# Altium schematic sheet BMS Carrier - Battery Relay Controls.SchDoc: BMS Fan and Relay Control
size B; Author: Kevin Chen, Taiping Li; DocumentNumber: 4; SheetNumber: 4; SheetTotal: 4; Website: www.uwmidsun.com
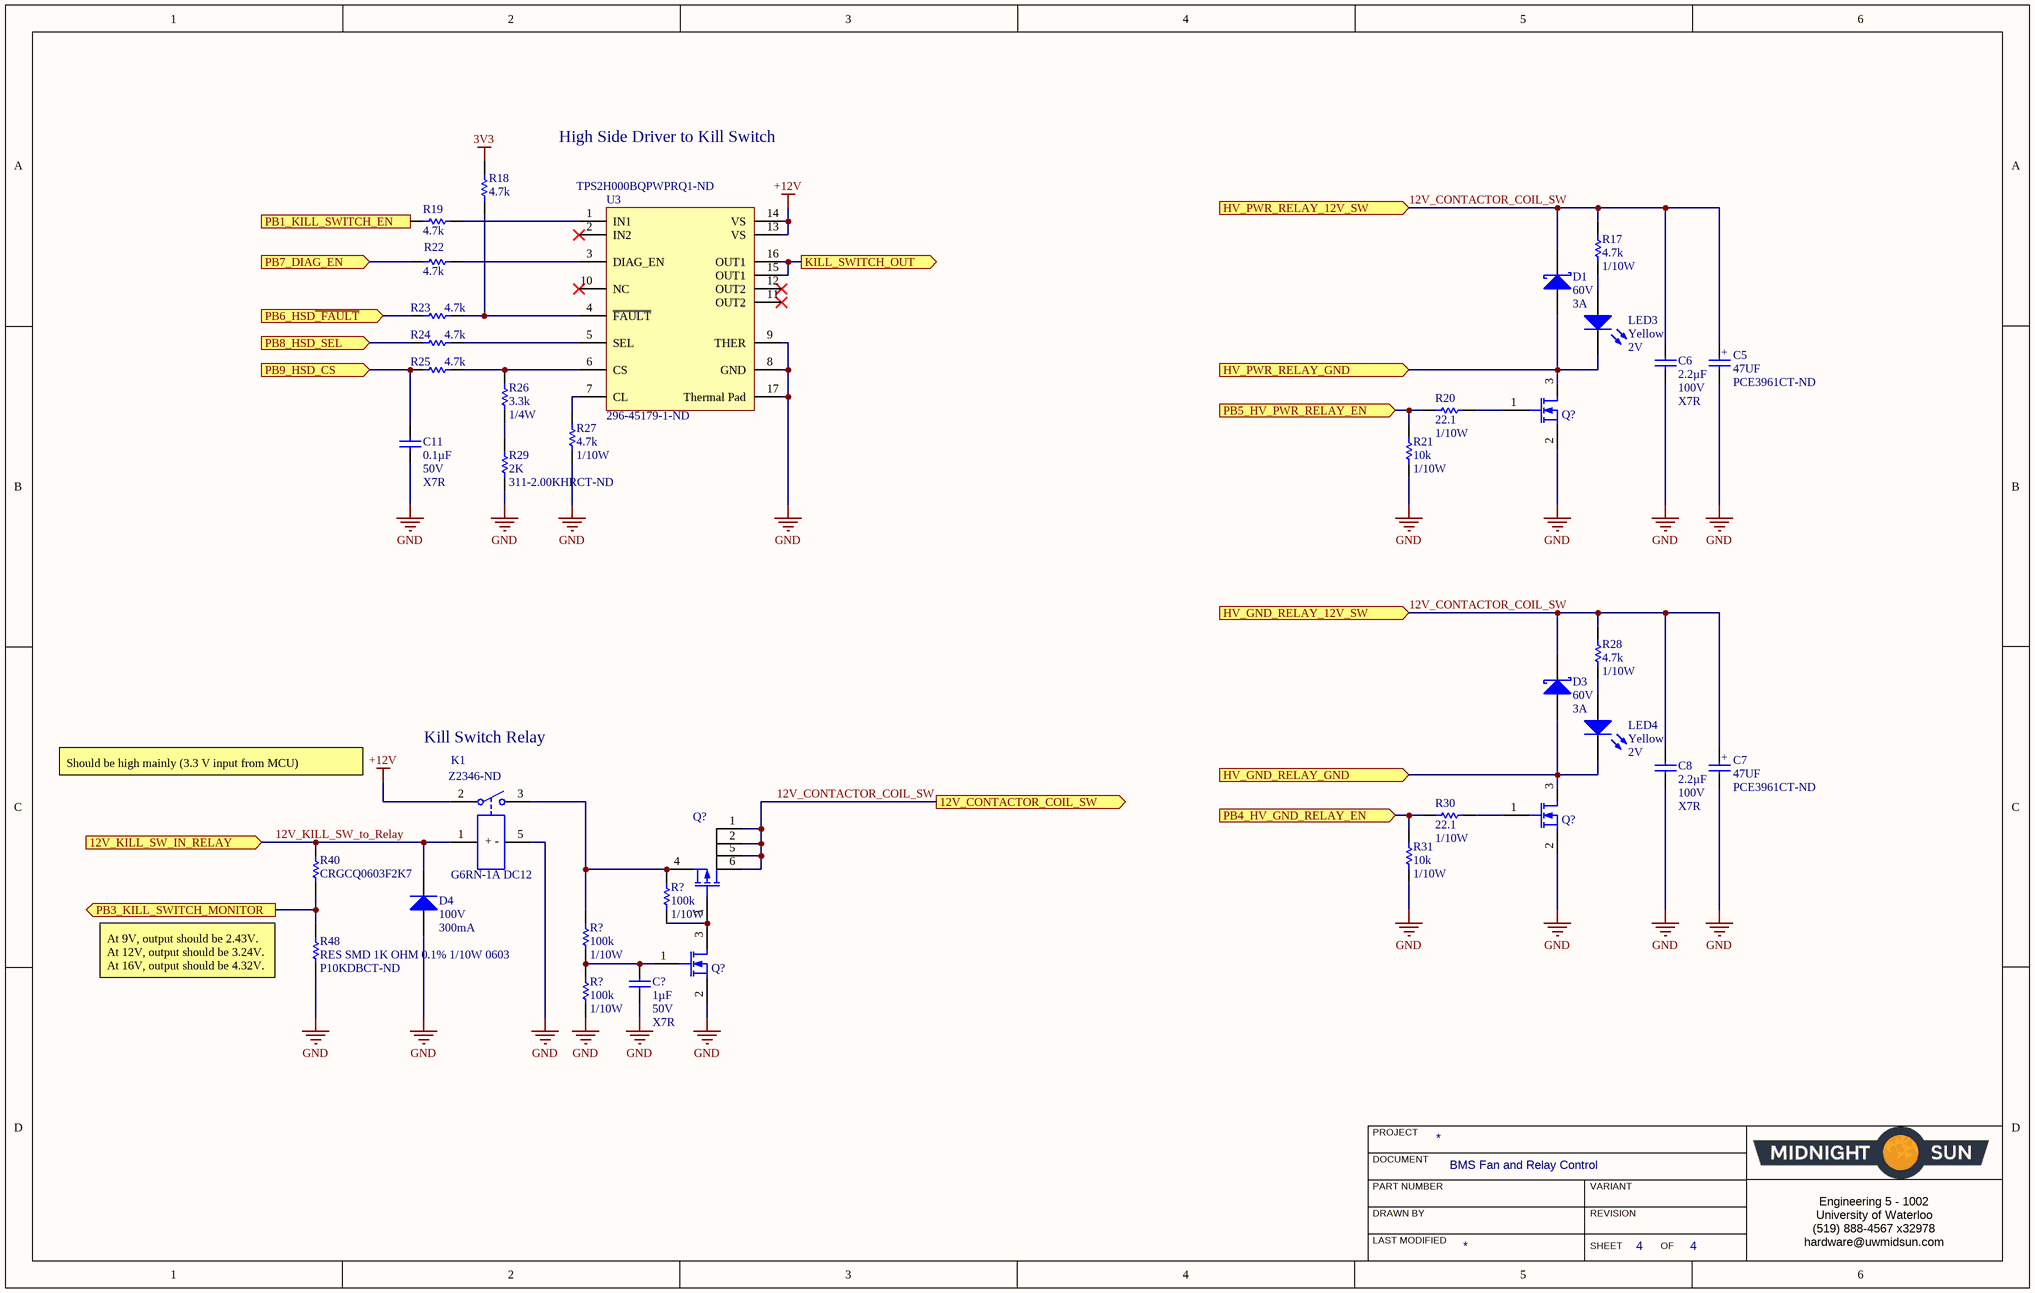
[diagram p0: BMS Carrier - Battery Relay Controls.SchDoc]

## Parts
(Parts that share a designator on the sheet are numbered #1, #2 ... from top to bottom, then left to right.)
C5  47UF  Supplier Part Number 1: PCE3961CT-ND  [CAP ALUM 6.3MM RADIAL SMD]
C6  Capacitance: 2.2µF  Voltage: 100V  Temperature Coefficient: X7R  [CAP, 1206]  (hidden comment: CAP CER 2.2UF 100V ±20% X7R 1206)
C7  47UF  Supplier Part Number 1: PCE3961CT-ND  [CAP ALUM 6.3MM RADIAL SMD]
C8  Capacitance: 2.2µF  Voltage: 100V  Temperature Coefficient: X7R  [CAP, 1206]  (hidden comment: CAP CER 2.2UF 100V ±20% X7R 1206)
C11  Capacitance: 0.1µF  Voltage: 50V  Temperature Coefficient: X7R  [CAP, 0603]  (hidden comment: CAP CER 0.1UF 50V 10% X7R 0603)
C?  Capacitance: 1µF  Voltage: 50V  Temperature Coefficient: X7R  [CAP, 0603]  (hidden comment: CAP CER 1UF 50V 10% X7R 0603)
D1  Voltage - DC Reverse (Vr) (Max): 60V  Current - Average Rectified (Io): 3A  [Diode, SMA]  (hidden comment: DIODE SCHOTTKY 60V 3A SMA)
D3  Voltage - DC Reverse (Vr) (Max): 60V  Current - Average Rectified (Io): 3A  [Diode, SMA]  (hidden comment: DIODE SCHOTTKY 60V 3A SMA)
D4  Max Repetitive Reverse Voltage (Vrrm): 100V  Forward Current: 300mA  [DIODE GEN PURP 100V 300MA SOD123]  (hidden comment: DIODE GEN PURP 100V 300MA SOD123)
K1  G6RN-1A DC12  Supplier Part Number 2: Z2346-ND  [RELAY SPST 8A 12VDC]
LED3  Color: Yellow  Voltage - Forward (Vf) (Typ): 2V  [LED_0603]  (hidden comment: LED YELLOW CLEAR 2.1V 0603)
LED4  Color: Yellow  Voltage - Forward (Vf) (Typ): 2V  [LED_0603]  (hidden comment: LED YELLOW CLEAR 2.1V 0603)
Q?#1  MOSFET N-CH 30V 6.2A 0.9W SOT-23  [MOSFET N-CH 30V 6.2A 0.9W SOT-23]  (value not drawn)
Q?#2  MOSFET N-CH 30V 6.2A 0.9W SOT-23  [MOSFET N-CH 30V 6.2A 0.9W SOT-23]  (value not drawn)
Q?#3  MOSFET P-CH 30V 4A 1.6W SOT-23-6  [P-MOSFET]  (value not drawn)
Q?#4  MOSFET N-CH 30V 6.2A 0.9W SOT-23  [MOSFET N-CH 30V 6.2A 0.9W SOT-23]  (value not drawn)
R17  Resistance (Ohms): 4.7k  Power (Watts): 1/10W  [RES, 0603]  (hidden comment: RES 4.7K OHM 1% 1/10W 0603)
R18  Resistance (Ohms): 4.7k  [RES, 0603]  (hidden comment: RES 10K OHM 1% 1/10W 0603)
R19  Resistance (Ohms): 4.7k  [RES, 0603]  (hidden comment: RES 4.7K OHM 1% 1/10W 0603)
R20  Resistance: 22.1  Power: 1/10W  [RES, 0603]  (hidden comment: RES 22.1 OHM 1% 1/10W 0603)
R21  Resistance: 10k  Power: 1/10W  [RES, 0603]  (hidden comment: RES 10K OHM 1% 1/10W 0603)
R22  Resistance (Ohms): 4.7k  [RES, 0603]  (hidden comment: RES 4.7K OHM 1% 1/10W 0603)
R23  Resistance (Ohms): 4.7k  [RES, 0603]  (hidden comment: RES 4.7K OHM 1% 1/10W 0603)
R24  Resistance (Ohms): 4.7k  [RES, 0603]  (hidden comment: RES 4.7K OHM 1% 1/10W 0603)
R25  Resistance (Ohms): 4.7k  [RES, 0603]  (hidden comment: RES 4.7K OHM 1% 1/10W 0603)
R26  Resistance: 3.3k  Power: 1/4W  [RES, 0603]  (hidden comment: RES 3.3K OHM 1% 1/4W 0603)
R27  Resistance (Ohms): 4.7k  Power (Watts): 1/10W  [RES, 0603]  (hidden comment: RES 4.7K OHM 1% 1/10W 0603)
R28  Resistance (Ohms): 4.7k  Power (Watts): 1/10W  [RES, 0603]  (hidden comment: RES 4.7K OHM 1% 1/10W 0603)
R29  2K  Supplier Part Number 1: 311-2.00KHRCT-ND  [RES, 0603]
R30  Resistance: 22.1  Power: 1/10W  [RES, 0603]  (hidden comment: RES 22.1 OHM 1% 1/10W 0603)
R31  Resistance: 10k  Power: 1/10W  [RES, 0603]  (hidden comment: RES 10K OHM 1% 1/10W 0603)
R40  Manufacturer Part Number: CRGCQ0603F2K7  [RES, 0603]  (hidden comment: RES 2.7K OHM 1% 1/10W 0603)
R48  RES SMD 1K OHM 0.1% 1/10W 0603  Supplier Part Number 1: P10KDBCT-ND  [RES, 0603]
R?#1  Resistance: 100k  Power: 1/10W  [RES, 0603]  (hidden comment: RES 100K OHM 5% 1/8W 0603)
R?#2  Resistance: 100k  Power: 1/10W  [RES, 0603]  (hidden comment: RES 100K OHM 5% 1/8W 0603)
R?#3  Resistance: 100k  Power: 1/10W  [RES, 0603]  (hidden comment: RES 100K OHM 5% 1/8W 0603)
U3  296-45179-1-ND  Supplier Part Number 1: TPS2H000BQPWPRQ1-ND  [IC HSD Dual-Channel TSOP65P640X120_HS-17N]

## Ports
12V_CONTACTOR_COIL_SW (out), 12V_KILL_SW_IN_RELAY (in), HV_GND_RELAY_12V_SW (in), HV_GND_RELAY_GND (in), HV_PWR_RELAY_12V_SW (in), HV_PWR_RELAY_GND (in), KILL_SWITCH_OUT (out), PB1_KILL_SWITCH_EN (in), PB3_KILL_SWITCH_MONITOR (out), PB4_HV_GND_RELAY_EN (in), PB5_HV_PWR_RELAY_EN (in), PB6_HSD~{_FAULT} (in), PB7_DIAG_EN (in), PB8_HSD_SEL (in), PB9_HSD_CS (in)

## Nets
3V3: R18.2
+12V: K1.2 U3.13(VS) U3.14(VS)
GND: C5.2 C6.2 C7.2 C8.2 C11.2 C?.2 D4.1(A) K1.5(-) Q?#1.2(S) Q?#2.2(S) Q?#4.2(S) R21.2 R27.2 R29.2 R31.2 R48.1 R?#3.2 U3.8(GND) U3.9(THER) U3.17(Thermal_Pad)
12V_CONTACTOR_COIL_SW: C5.1 C6.1 C7.1 C8.1 D1.2 D3.2 Q?#3.1(D) Q?#3.2(D) Q?#3.5(D) Q?#3.6(D) R17.1 R28.1 ; port HV_PWR_RELAY_12V_SW, port HV_GND_RELAY_12V_SW, port 12V_CONTACTOR_COIL_SW
12V_KILL_SW_to_Relay: D4.2(K) K1.1(+) R40.1 ; port 12V_KILL_SW_IN_RELAY
HV_GND_RELAY_GND: D3.1 LED4.2(K) Q?#2.3(D) ; port HV_GND_RELAY_GND
HV_PWR_RELAY_GND: D1.1 LED3.2(K) Q?#1.3(D) ; port HV_PWR_RELAY_GND
KILL_SWITCH_OUT: U3.15(OUT1) U3.16(OUT1) ; port KILL_SWITCH_OUT
PB1_KILL_SWITCH_EN: R19.1 ; port PB1_KILL_SWITCH_EN
PB3_KILL_SWITCH_MONITOR: R40.2 R48.2 ; port PB3_KILL_SWITCH_MONITOR
PB4_HV_GND_RELAY_EN: R30.1 R31.1 ; port PB4_HV_GND_RELAY_EN
PB5_HV_PWR_RELAY_EN: R20.1 R21.1 ; port PB5_HV_PWR_RELAY_EN
PB6_HSD~{_FAULT}: R23.1 ; port PB6_HSD~{_FAULT}
PB7_DIAG_EN: R22.1 ; port PB7_DIAG_EN
PB8_HSD_SEL: R24.1 ; port PB8_HSD_SEL
PB9_HSD_CS: C11.1 R25.1 ; port PB9_HSD_CS
NetC?_1: C?.1 Q?#4.1(G) R?#1.2 R?#3.1
NetK1_3: K1.3 Q?#3.4(S) R?#1.1 R?#2.2
NetLED3_1: LED3.1(A) R17.2
NetLED4_1: LED4.1(A) R28.2
NetQ?#1_1: Q?#1.1(G) R20.2
NetQ?#2_1: Q?#2.1(G) R30.2
NetQ?#3_3: Q?#3.3(G) Q?#4.3(D) R?#2.1
NetR18_1: R18.1 R23.2 U3.4(~{FAULT})
NetR19_2: R19.2 U3.1(IN1)
NetR22_2: R22.2 U3.3(DIAG_EN)
NetR24_2: R24.2 U3.5(SEL)
NetR25_2: R25.2 R26.1 U3.6(CS)
NetR26_2: R26.2 R29.1
NetR27_1: R27.1 U3.7(CL)

Not connected (* = marked no-connect by the designer): U3 2(IN2)* 10(NC)* 11(OUT2)* 12(OUT2)*

## Notes on the sheet
- High Side Driver to Kill Switch
- Should be high mainly (3.3 V input from MCU)
- Kill Switch Relay
- At 9V, output should be 2.43V. At 12V, output should be 3.24V. At 16V, output should be 4.32V.
- PROJECT
- DOCUMENT
- DRAWN BY
- LAST MODIFIED
- PART NUMBER
- REVISION
- SHEET
- VARIANT
- OF
- Engineering 5 - 1002
  University of Waterloo
  (519) 888-4567 x32978
  hardware@uwmidsun.com
- (in symbol CAP ALUM 47UF 20% 35V SMD) +
- (in symbol RELAY SPST 12V 8A OMRON) + -

## Library data of the parts
C5 C7 = CAP ALUM 47UF 20% 35V SMD: 47µF 35V Aluminum Electrolytic Capacitors Radial, Can - SMD 1000 Hrs @ 85°C; Manufacturer: Panasonic; Manufacturer Part Number: EEE-1VA470WP; Ripple Current: 70mA; Tolerance: 20%; Life (Hours): 1000Hour; Supplier 1: Digi-Key; Stock 1: 2820; Pricing 1: 1=0.38, 10=0.263, 100=0.1579, 500=0.11846 (USD); Mount: Surface Mount,PCB; Case/Package: Radial; Min Operating Temperature: -40°C; Max Operating Temperature: 85°C; Voltage Rating: 35V; Ripple Current (AC): 70mA; Packaging: Tape and Reel; Package Quantity: 1; Termination: SMD/SMT; Diameter: 6.3mm; Length: 5.5mm; Height: 5.4mm; Height - Seated (Max): 0.213inch; Radiation Hardening: No; REACH SVHC: Unknown; Lead Free: Lead Free; ComponentLink1URL: https://datasheet.ciiva.com/2983/aba0000ce2-2983926.pdf; ComponentLink1Description: https://datasheet.ciiva.com/2983/aba0000ce2-2983926.pdf; ComponentLink2URL: https://datasheet.ciiva.com/2983/aba0000ce2-2983927.pdf; ComponentLink2Description: https://datasheet.ciiva.com/2983/aba0000ce2-2983927.pdf; ComponentLink3URL: https://datasheet.ciiva.com/14598/70255710-14598937.pdf; ComponentLink3Description: https://datasheet.ciiva.com/14598/70255710-14598937.pdf; ComponentLink4URL: https://datasheet.ciiva.com/15165/getdatasheetpartid-86239-15165868.pdf; ComponentLink4Description: https://datasheet.ciiva.com/15165/getdatasheetpartid-86239-15165868.pdf; ComponentLink5URL: https://datasheet.ciiva.com/16507/aba0000ce2-16507965.pdf; ComponentLink5Description: https://datasheet.ciiva.com/16507/aba0000ce2-16507965.pdf; ComponentLink6URL: https://datasheet.ciiva.com/30206/11aba0000ce2-30206253.pdf; ComponentLink6Description: https://datasheet.ciiva.com/30206/11aba0000ce2-30206253.pdf; Capacitance: 47uF; Voltage Rating (DC): 35V; Contact Plating: Tin
C6 C8 = CAP CER 2.2UF 100V ±20% X7R 1206: 2.2µF ±20% 100V Ceramic Capacitor X7R 1206 (3216 Metric); Manufacturer 1: Murata Electronics North America; Manufacturer Part Number 1: GRM31CR72A225MA73L; Supplier 1: Digi-Key; Supplier Part Number 1: 490-12773-1-ND; Packaging: Cut Tape (CT); Part Status: Active; Operating Temperature: -55°C ~ 125°C; Ratings: -; Mounting Type: Surface Mount, MLCC; Package / Case: 1206 (3216 Metric); Size / Dimension: 0.126" L x 0.063" W (3.20mm x 1.60mm); Height - Seated (Max): -; Thickness (Max): 0.071" (1.80mm); Lead Spacing: -; Lead Style: -; ComponentLink1URL: http://www.murata.com/~/media/webrenewal/support/library/catalog/products/capacitor/mlcc/c02e.ashx; ComponentLink1Description: http://www.murata.com/~/media/webrenewal/support/library/catalog/products/capacitor/mlcc/c02e.ashx; Tolerance: ±20%
C11 = CAP CER 0.1UF 50V 10% X7R 0603: 0.10µF ±10% 50V Ceramic Capacitor X7R 0603 (1608 Metric); Manufacturer 1: AVX Corporation; Manufacturer Part Number 1: 06035C104KAT2A; Supplier 1: Digi-Key; Supplier Part Number 1: 478-5052-1-ND; Packaging: Cut Tape (CT); Part Status: Active; Operating Temperature: -55°C ~ 125°C; Ratings: -; Mounting Type: Surface Mount, MLCC; Package / Case: 0603 (1608 Metric); Size / Dimension: 0.063" L x 0.032" W (1.60mm x 0.81mm); Height - Seated (Max): -; Thickness (Max): 0.035" (0.90mm); Lead Spacing: -; Lead Style: -; ComponentLink1URL: http://datasheets.avx.com/X7RDielectric.pdf; ComponentLink1Description: http://datasheets.avx.com/X7RDielectric.pdf; Tolerance: ±10%
C? = CAP CER 1UF 50V 10% X7R 0603: 1µF ±10% 50V Ceramic Capacitor X7R 0603 (1608 Metric); Manufacturer 1: Taiyo Yuden; Manufacturer Part Number 1: UMK107AB7105KA-T; Supplier 1: Digi-Key; Supplier Part Number 1: 587-3247-1-ND; Packaging: Cut Tape (CT); Part Status: Active; Operating Temperature: -55°C ~ 125°C; Ratings: -; Mounting Type: Surface Mount, MLCC; Package / Case: 0603 (1608 Metric); Size / Dimension: 0.063" L x 0.031" W (1.60mm x 0.80mm); Height - Seated (Max): -; Thickness (Max): 0.037" (0.95mm); Lead Spacing: -; Lead Style: -; ComponentLink1URL: http://www.yuden.co.jp/productdata/catalog/en/mlcc_all_e.pdf; ComponentLink1Description: http://www.yuden.co.jp/productdata/catalog/en/mlcc_all_e.pdf; Tolerance: ±10%
D1 D3 = DIODE SCHOTTKY 60V 3A SMA: Diode Schottky 60V 3A Surface Mount SMA; Manufacturer 1: Diodes Incorporated; Manufacturer Part Number 1: B360A-13-F; Voltage - Forward (Vf) (Max) @ If: 700mV @ 3A; Speed: Fast Recovery =< 500ns, > 200mA (Io); Current - Reverse Leakage @ Vr: 500µA @ 60V; Capacitance @ Vr, F: 200pF @ 4V, 1MHz; Supplier 1: Digi-Key; Supplier Part Number 1: B360A-FDICT-ND; Packaging: Cut Tape (CT); Part Status: Active; Diode Type: Schottky; Mounting Type: Surface Mount; Package / Case: DO-214AC, SMA; Supplier Device Package: SMA; Operating Temperature - Junction: -55°C ~ 150°C; ComponentLink1URL: https://www.diodes.com/assets/Datasheets/ds30891.pdf; ComponentLink1Description: https://www.diodes.com/assets/Datasheets/ds30891.pdf
D4 = DIODE GEN PURP 100V 300MA SOD123: Diode Standard 100V 300mA (DC) Surface Mount SOD-123; Manufacturer: Diodes Zetex; Manufacturer Part Number: 1N4148WQ-7-F; Max Surge Current: 2A; Forward Voltage: 1.25V; Element Configuration: Single; Recovery Time: 4ns; Peak Reverse Current: 50uA; Max Power Dissipation: 400mW; Supplier 1: Digi-Key; Stock 1: 229; Pricing 1: 1=0.22, 10=0.196, 100=0.107, 500=0.0658, 1000=0.0449 (USD); Mount: Surface Mount; Case/Package: SOD-123-2; Number of Pins: 2; Weight: 0.000353oz; Contact Plating: Tin,Matte; Min Operating Temperature: -65°C; Max Operating Temperature: 150°C; Packaging: Tape and Reel; Peak Non-Repetitive Surge Current: 2A; Package Quantity: 3000; Reverse Recovery Time: 4ns; Lead Free: Lead Free; ComponentLink1URL: http://components.arrow.com/part/dataview/0323_07206809; ComponentLink1Description: http://components.arrow.com/part/dataview/0323_07206809; ComponentLink2URL: http://www.diodes.com/datasheets/ds30086.pdf; ComponentLink2Description: http://www.diodes.com/datasheets/ds30086.pdf; ComponentLink3URL: http://www.mouser.com/ds/2/115/ds30086-318161.pdf; ComponentLink3Description: http://www.mouser.com/ds/2/115/ds30086-318161.pdf; Supplier Part Number 1: 1N4148WQ-7-FDICT-ND
K1 = RELAY SPST 12V 8A OMRON: Omron Relay SPST (1 Form A) Through Hole; Coil Type: Non Latching; Coil Voltage: 12V; Switching Voltage: 250VAC, 30VDC - Max; Operate Time: 15ms; Coil Power: 220 mW; Contact Form: SPST; Manufacturer Part Number: G6RN-1A DC12; Supplier 1: Digi-Key; Supplier 2: Digi-Key; ComponentLink1Description: Datasheet; ComponentLink1URL: https://omronfs.omron.com/en_US/ecb/products/pdf/en-g6rn.pdf
LED3 LED4 = LED YELLOW CLEAR 2.1V 0603: Yellow 590nm LED Indication - Discrete 2V 0603 (1608 Metric); Manufacturer: Wurth Electronics Inc.; Manufacturer Part Number: 150060YS75000; Lens Color: Colorless; Millicandela Rating: 120mcd; Lens Style/Size: Rectangle with Flat Top, 1.10mm x 0.70mm; Current - Test: 20mA; Viewing Angle: 140°; Wavelength - Peak: 595nm; Supplier 1: Digi-Key; RoHS: RoHS Compliant; Category: Optoelectronics; Stock 1: 10523; Pricing 1: 1=0.21, 100=0.1617, 500=0.13964 (CAD); Packaging: Cut Tape (CT); Part Status: Active; Lens Transparency: Clear; Mounting Type: Surface Mount; Wavelength - Dominant: 590nm; Features: -; Package / Case: 0603 (1608 Metric); Supplier Device Package: 0603; Size / Dimension: 1.60mm L x 0.80mm W; Height (Max): 0.80mm; ComponentLink1URL: http://katalog.we-online.de/led/datasheet/150060YS75000.pdf; ComponentLink1Description: http://katalog.we-online.de/led/datasheet/150060YS75000.pdf; Supplier Part Number 1: 732-4981-1-ND
Q?#1 Q?#2 Q?#4 = MOSFET N-CH 30V 6.2A 0.9W SOT-23: N-Channel 30V 6.2A (Ta) 900mW (Ta) Surface Mount SOT-23; Manufacturer: Diodes; Manufacturer Part Number: DMN3023L-7; Rds On Max: 25mR; Input Capacitance: 873pF; Supplier 1: Digi-Key; Stock 1: 38246; Pricing 1: 1=0.47, 10=0.368, 100=0.2529, 500=0.1734, 1000=0.1301 (USD); Mount: Surface Mount; Case/Package: TO-236-3; Min Operating Temperature: -55°C; Max Operating Temperature: 150°C; Packaging: Tape and Reel; Drain to Source Voltage (Vdss): 30V; Continuous Drain Current (ID): 6.2A; Max Power Dissipation: 900mW; ComponentLink1URL: https://www.diodes.com/assets/Datasheets/DMN3023L.pdf; ComponentLink1Description: https://www.diodes.com/assets/Datasheets/DMN3023L.pdf; ComponentLink2URL: http://www.mouser.com/ds/2/115/DMN3023L-959533.pdf; ComponentLink2Description: http://www.mouser.com/ds/2/115/DMN3023L-959533.pdf; Supplier Part Number 1: DMN3023L-7DICT-ND
Q?#3 = MOSFET P-CH 30V 4A 1.6W SOT-23-6: P-Channel 30V 4A (Ta) 1.6W (Ta) Surface Mount SOT-23-6; Manufacturer 1: STMicroelectronics; Manufacturer Part Number 1: STT4P3LLH6; Current - Continuous Drain (Id) @ 25°C: 4A (Ta); Drive Voltage (Max Rds On,  Min Rds On): 4.5V, 10V; Vgs(th) (Max) @ Id: 2.5V @ 250µA; Gate Charge (Qg) (Max) @ Vgs: 6nC @ 4.5V; Input Capacitance (Ciss) (Max) @ Vds: 639pF @ 25V; Vgs (Max): ±20V; Rds On (Max) @ Id, Vgs: 56 mOhm @ 2A, 10V; Supplier 1: Digi-Key; Supplier Part Number 1: 497-15521-1-ND; Packaging: Cut Tape (CT); Part Status: Active; FET Type: P-Channel; Technology: MOSFET (Metal Oxide); Drain to Source Voltage (Vdss): 30V; FET Feature: -; Power Dissipation (Max): 1.6W (Ta); Operating Temperature: 150°C (TJ); Mounting Type: Surface Mount; Supplier Device Package: SOT-23-6; Package / Case: SOT-23-6; ComponentLink1URL: http://www.st.com/content/ccc/resource/technical/document/datasheet/13/e4/a1/65/8b/79/44/73/DM00084060.pdf/files/DM00084060.pdf/jcr:content/translations/en.DM00084060.pdf; ComponentLink1Description: http://www.st.com/content/ccc/resource/technical/document/datasheet/13/e4/a1/65/8b/79/44/73/DM00084060.pdf/files/DM00084060.pdf/jcr:content/translations/en.DM00084060.pdf
R17-R19 R22-R25 R27 R28 = RES 4.7K OHM 1% 1/10W 0603: 4.7k Ohm ±1% 0.1W, 1/10W Chip Resistor 0603 (1608 Metric) Moisture Resistant Thick Film; Manufacturer 1: Yageo; Manufacturer Part Number 1: RC0603FR-074K7L; Description 1: RES SMD 4.7K OHM 1% 1/10W 0603; Temperature Coefficient: ±100ppm/°C; Supplier 1: Digi-Key; Supplier Part Number 1: 311-4.70KHRCT-ND; RoHS: RoHS Compliant; Category: Resistors; Stock 1: 3487566; Pricing 1: 1=0.16, 10=0.022, 100=0.0089, 1000=0.00402, 2500=0.00349 (CAD); Packaging: Cut Tape (CT); Part Status: Active; Composition: Thick Film; Features: Moisture Resistant; Operating Temperature: -55°C ~ 155°C; Package / Case: 0603 (1608 Metric); Supplier Device Package: 0603; Size / Dimension: 0.063" L x 0.031" W (1.60mm x 0.80mm); Height - Seated (Max): 0.022" (0.55mm); Failure Rate: -; ComponentLink1URL: http://www.yageo.com/documents/recent/PYu-RC_Group_51_RoHS_L_7.pdf; ComponentLink1Description: http://www.yageo.com/documents/recent/PYu-RC_Group_51_RoHS_L_7.pdf; Tolerance: ±1%
  R18 R19 R22-R25: Power (Watts): 1/10W
R20 R30 = RES 22.1 OHM 1% 1/10W 0603: 22.1 Ohm ±1% 0.1W, 1/10W Chip Resistor 0603 (1608 Metric) Moisture Resistant Thick Film; Manufacturer 1: Yageo; Manufacturer Part Number 1: RC0603FR-0722R1L; Temperature Coefficient: ±100ppm/°C; Supplier 1: Digi-Key; Supplier Part Number 1: 311-22.1HRCT-ND; Packaging: Cut Tape (CT); Part Status: Active; Composition: Thick Film; Operating Temperature: -55°C ~ 155°C; Package / Case: 0603 (1608 Metric); Supplier Device Package: 0603; Size / Dimension: 0.063" L x 0.031" W (1.60mm x 0.80mm); Height - Seated (Max): 0.022" (0.55mm); Failure Rate: -; ComponentLink1URL: http://www.yageo.com/documents/recent/PYu-RC_Group_51_RoHS_L_7.pdf; ComponentLink1Description: http://www.yageo.com/documents/recent/PYu-RC_Group_51_RoHS_L_7.pdf; Tolerance: ±1%
R21 R31 = RES 10K OHM 1% 1/10W 0603: RES SMD 10K OHM 1% 1/10W 0603; Manufacturer 1: Yageo; Manufacturer Part Number 1: RC0603FR-0710KL; Temperature Coefficient: ±100ppm/°C; Supplier 1: Digi-Key; Supplier Part Number 1: 311-10.0KHRCT-ND; Packaging: Cut Tape (CT); Part Status: Active; Composition: Thick Film; Operating Temperature: -55°C ~ 155°C; Package / Case: 0603 (1608 Metric); Supplier Device Package: 0603; Size / Dimension: 0.063" L x 0.031" W (1.60mm x 0.80mm); Height - Seated (Max): 0.022" (0.55mm); Failure Rate: -; ComponentLink1URL: http://www.yageo.com/documents/recent/PYu-RC_Group_51_RoHS_L_7.pdf; ComponentLink1Description: http://www.yageo.com/documents/recent/PYu-RC_Group_51_RoHS_L_7.pdf; Tolerance: ±1%
R26 = RES 3.3K OHM 1% 1/4W 0603: 3.3k Ohm ±1% 0.25W, 1/4W Chip Resistor 0603 (1608 Metric) Automotive AEC-Q200, Pulse Withstanding Thick Film; Manufacturer 1: Panasonic Electronic Components; Manufacturer Part Number 1: ERJ-PA3F3301V; Temperature Coefficient: ±100ppm/°C; Supplier 1: Digi-Key; Supplier Part Number 1: P3.3KBYCT-ND; Packaging: Cut Tape (CT); Part Status: Active; Composition: Thick Film; Operating Temperature: -55°C ~ 155°C; Package / Case: 0603 (1608 Metric); Supplier Device Package: 0603; Size / Dimension: 0.063" L x 0.031" W (1.60mm x 0.80mm); Height - Seated (Max): 0.022" (0.55mm); Failure Rate: -; ComponentLink1URL: https://industrial.panasonic.com/cdbs/www-data/pdf/RDO0000/AOA0000C291.pdf; ComponentLink1Description: https://industrial.panasonic.com/cdbs/www-data/pdf/RDO0000/AOA0000C291.pdf; Tolerance: ±1%
R29 = RES 2K OHM 1% 1/10W 0603: 2k Ohm ±1% 0.1W, 1/10W Chip Resistor 0603 (1608 Metric) Moisture Resistant Thick Film; Manufacturer: Yageo; Manufacturer Part Number: RC0603FR-072KL; Temperature Coefficient: ±100ppm/°C; Supplier 1: Digi-Key; RoHS: RoHS Compliant; Category: Resistors; Stock 1: 1750701; Pricing 1: 1=0.15, 10=0.023, 100=0.0093, 1000=0.00415, 2500=0.0036 (CAD); Packaging: Cut Tape (CT); Part Status: Active; Resistance (Ohms): 2k; Tolerance: ±1%; Power (Watts): 0.1W, 1/10W; Composition: Thick Film; Features: Moisture Resistant; Operating Temperature: -55°C ~ 155°C; Package / Case: 0603 (1608 Metric); Supplier Device Package: 0603; Size / Dimension: 0.063" L x 0.031" W (1.60mm x 0.80mm); Height - Seated (Max): 0.022" (0.55mm); Failure Rate: -; ComponentLink1URL: http://www.yageo.com/documents/recent/PYu-RC_Group_51_RoHS_L_7.pdf; ComponentLink1Description: http://www.yageo.com/documents/recent/PYu-RC_Group_51_RoHS_L_7.pdf
R40 = RES 2.7K OHM 1% 1/10W 0603: 2.7 kOhms ±1% 0.1W, 1/10W Chip Resistor 0603 (1608 Metric) Automotive AEC-Q200, Moisture Resistant Thick Film; Manufacturer: TE Connectivity; Supplier 1: Digi-Key; Supplier Part Number 1: A129693CT-ND; RoHS: No; Stock 1: 137187; Pricing 1: 1 = 0.10000, 10 = 0.03300, 100 = 0.01320, 1000 = 0.00595, 2500 = 0.00516 (USD); ComponentLink1URL: http://www.te.com/commerce/DocumentDelivery/DDEController?Action=srchrtrv&DocNm=1773204-3&DocType=DS&DocLang=English&src-supplier=Digi-Key; ComponentLink1Description: http://www.te.com/commerce/DocumentDelivery/DDEController?Action=srchrtrv&DocNm=1773204-3&DocType=DS&DocLang=English&src-supplier=Digi-Key; ComponentLink2URL: https://www.te.com/commerce/DocumentDelivery/DDEController?Action=srchrtrv&DocNm=1773204-3&DocType=DS&DocLang=English&src-supplier=Digi-Key; ComponentLink2Description: https://www.te.com/commerce/DocumentDelivery/DDEController?Action=srchrtrv&DocNm=1773204-3&DocType=DS&DocLang=English&src-supplier=Digi-Key
R48 = RES SMD 1K OHM 0.1% 1/10W 0603: 1 kOhms ±0.1% 0.1W, 1/10W Chip Resistor 0603 (1608 Metric) Automotive AEC-Q200 Thin Film; Manufacturer: Panasonic; Manufacturer Part Number: ERA3AEB103V; Resistance: 10kR; Power Rating: 100mW; Voltage Rating: 75V; Temperature Coefficient: 25ppm/°C; ComponentLink1Description: Digikey; ComponentLink1URL: https://www.digikey.ca/product-detail/en/panasonic-electronic-components/ERA-3AEB102V/P1.0KDBCT-ND/1466052; Supplier 1: Digi-Key; RoHS: Yes; Stock 1: 2747820; Pricing 1: 1 = 0.35000, 10 = 0.30000, 100 = 0.11720, 1000 = 0.04906, 2500 = 0.04498 (USD); Mount: Surface Mount; Case/Package: 0603; Number of Pins: 2; Case Code (Metric): 1608; Case Code (Imperial): 0603; Contact Plating: Tin; Min Operating Temperature: -55°C; Max Operating Temperature: 155°C; Packaging: Tape and Reel; Tolerance: 0.1%; Package Quantity: 5000; Composition: Metal Film,Thin Film; Number of Terminations: 2; Termination: SMD/SMT; Military Standard: Not; Max Power Dissipation: 100mW; Voltage Rating (DC): 75V; Length: 1.6mm; Height: 0.45mm; Width: 0.8mm; Depth: 0.8mm; Radiation Hardening: No; REACH SVHC: No SVHC; Lead Free: Lead Free; ComponentLink2URL: http://www.farnell.com/datasheets/485442.pdf; ComponentLink2Description: http://www.farnell.com/datasheets/485442.pdf; ComponentLink3URL: http://industrial.panasonic.com/www-data/pdf/AOA0000/AOA0000CE26.pdf; ComponentLink3Description: http://industrial.panasonic.com/www-data/pdf/AOA0000/AOA0000CE26.pdf; ComponentLink4URL: http://www.farnell.com/datasheets/2052875.pdf; ComponentLink4Description: http://www.farnell.com/datasheets/2052875.pdf; ComponentLink5URL: http://www.farnell.com/datasheets/1776116.pdf; ComponentLink5Description: http://www.farnell.com/datasheets/1776116.pdf; ComponentLink6URL: http://uk.rs-online.com/webdocs/148c/0900766b8148c4ab.pdf; ComponentLink6Description: http://uk.rs-online.com/webdocs/148c/0900766b8148c4ab.pdf; ComponentLink7URL: http://www.farnell.com/datasheets/2059650.pdf; ComponentLink7Description: http://www.farnell.com/datasheets/2059650.pdf; ComponentLink8URL: http://www.produktinfo.conrad.com/datenblaetter/450000-474999/451250-da-01-en-WIDERSTAND_0603_ERA.pdf; ComponentLink8Description: http://www.produktinfo.conrad.com/datenblaetter/450000-474999/451250-da-01-en-WIDERSTAND_0603_ERA.pdf
R?#1-R?#3 = RES 100K OHM 5% 1/8W 0603: RES SMD 100K OHM 5% 1/10W 0603; Manufacturer 1: Yageo; Manufacturer Part Number 1: RC0603JR-07100KL; Temperature Coefficient: ±100ppm/°C; Supplier 1: Digi-Key; Supplier Part Number 1: 311-100KGRCT-ND; Packaging: Cut Tape (CT); Part Status: Active; Composition: Thick Film; Operating Temperature: -55°C ~ 155°C; Package / Case: 0603 (1608 Metric); Supplier Device Package: 0603; Size / Dimension: 0.063" L x 0.031" W (1.60mm x 0.80mm); Height - Seated (Max): 0.022" (0.55mm); Failure Rate: -; ComponentLink1URL: http://www.yageo.com/documents/recent/PYu-RC_Group_51_RoHS_L_7.pdf; ComponentLink1Description: http://www.yageo.com/documents/recent/PYu-RC_Group_51_RoHS_L_7.pdf; Tolerance: ±5%
U3 = IC HSD Dual-Channel 40V 1KOhm: ComponentLink1Description: Datasheet; ComponentLink1URL: http://www.ti.com/lit/ds/symlink/tps2h000-q1.pdf; Supplier 1: Digi-Key; Supplier Part Number: 296-45179-1-ND; Manufacturer Part Number: TPS2H000BQPWPRQ1-ND